# EAGLE design NES_IO (EAGLE 7.2.0)
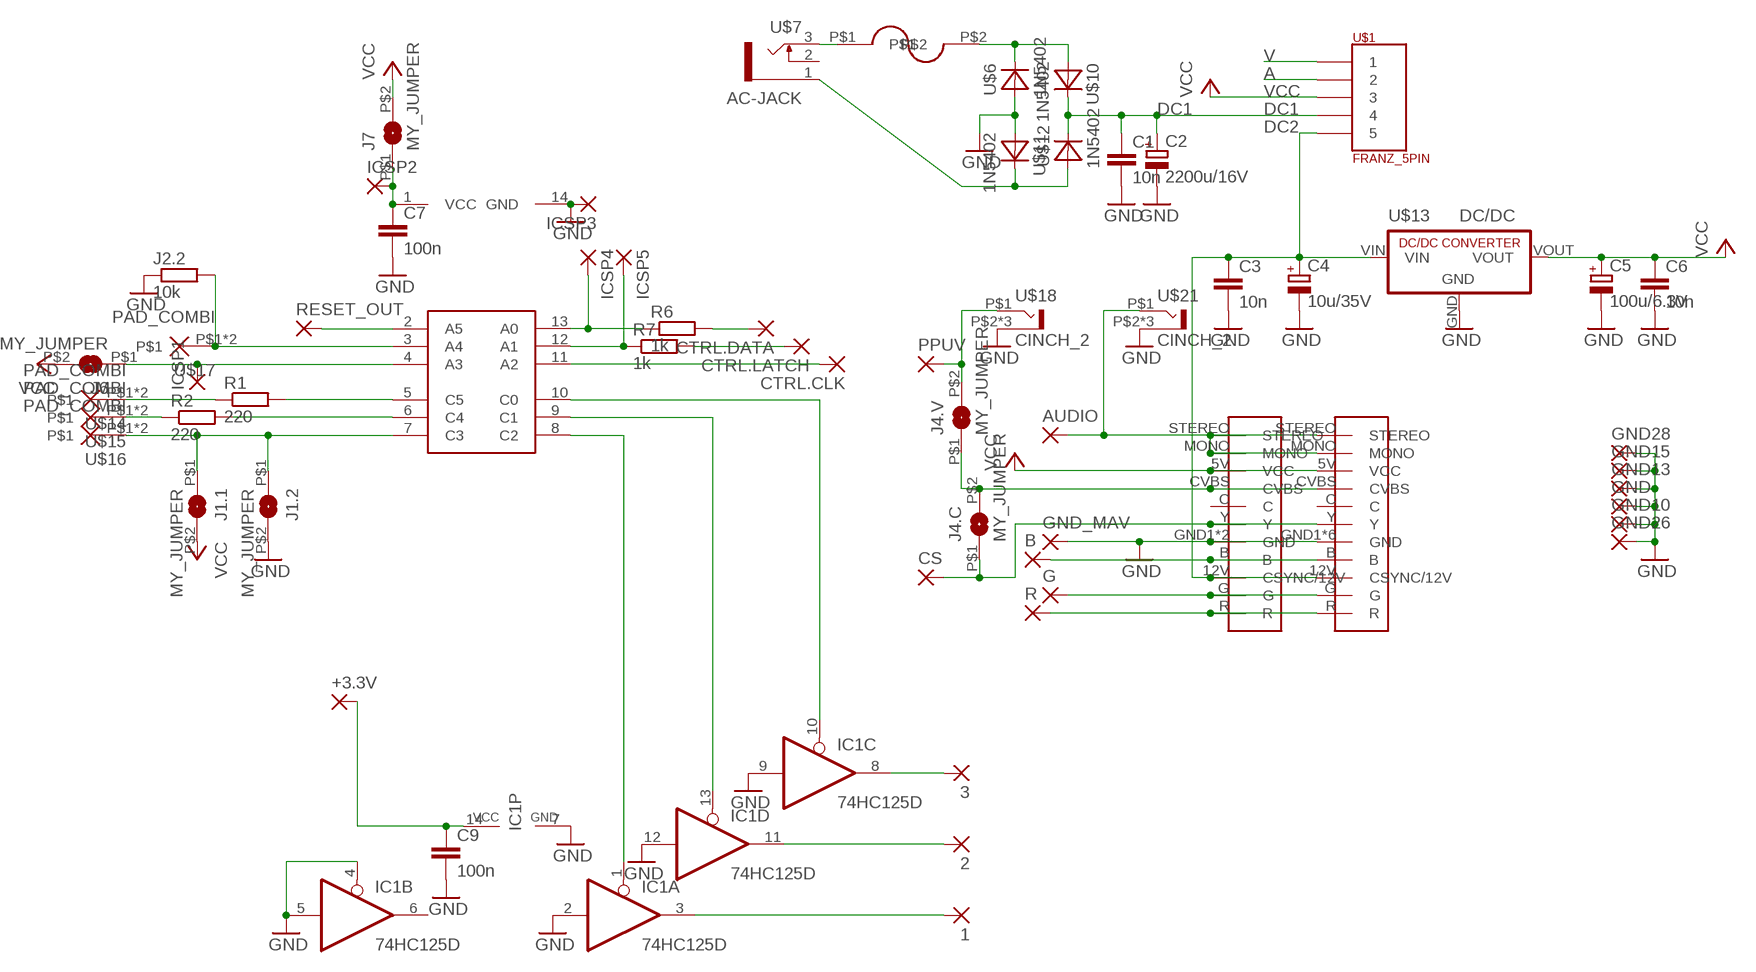
[diagram p0: schematic, sheet 1]

## Parts
1  SMD2  [SMD1,27-2,54]
2  SMD2  [SMD1,27-2,54]
3  SMD2  [SMD1,27-2,54]
+3.3V  SMD2  [SMD1,27-2,54]
AUDIO  SMD2  [SMD1,27-2,54]
B  SMD2  [SMD1,27-2,54]
C1  10n  C0805  [Z0805]
C2  2200u/16V  CPOL-EUE5-13  [E5-13]
C3  10n  C0805  [Z0805]
C4  10u/35V  CPOL-EUB  [PANASONIC_B]
C5  100u/6.3V  CPOL-EUD  [PANASONIC_D]
C6  10n  C0805  [Z0805]
C7  100n  C0805  [Z0805]
C9  100n  C0805  [Z0805]
CS  SMD2  [SMD1,27-2,54]
CTRL.CLK  SMD2  [SMD1,27-2,54]
CTRL.DATA  SMD2  [SMD1,27-2,54]
CTRL.LATCH  SMD2  [SMD1,27-2,54]
G  SMD2  [SMD1,27-2,54]
GND  SMD5  [SMD2,54-5,08]
GND10  SMD5  [SMD2,54-5,08]
GND13  SMD5  [SMD2,54-5,08]
GND15  SMD5  [SMD2,54-5,08]
GND26  SMD5  [SMD2,54-5,08]
GND28  SMD5  [SMD2,54-5,08]
GND_MAV  SMD2  [SMD1,27-2,54]
IC1  74HC125D  [SO14]
ICSP1  1,6/0,8  [1,6/0,8]
ICSP2  1,6/0,8  [1,6/0,8]
ICSP3  1,6/0,8  [1,6/0,8]
ICSP4  1,6/0,8  [1,6/0,8]
ICSP5  1,6/0,8  [1,6/0,8]
J1.1  MY_JUMPER  [MYJUMP]
J1.2  MY_JUMPER  [MYJUMP]
J2.2  10k  R0805  [Z0805]
J4.C  MY_JUMPER  [MYJUMP]
J4.V  MY_JUMPER  [MYJUMP]
J6  MY_JUMPER  [MYJUMP]
J7  MY_JUMPER  [MYJUMP]
PPUV  SMD2  [SMD1,27-2,54]
R  SMD2  [SMD1,27-2,54]
R1  220  R0805  [Z0805]
R2  220  R0805  [Z0805]
R6  1k  R0805  [Z0805]
R7  1k  R0805  [Z0805]
RESET_OUT  SMD2  [SMD1,27-2,54]
U$1  FRANZ_5PIN  [5X2.22RM4]
U$2  FUSEHOLDER  [FUSEHOLDER]
U$5  PIC16F630_SIMPLE  [PIC16F630]
U$6  1N5402  [DO201]
U$7  AC-JACK  [AC-JACK]
U$10  1N5402  [DO201]
U$11  1N5402  [DO201]
U$12  1N5402  [DO201]
U$13  DC/DC  [RECOM]
U$14  PAD_COMBI  [PAD_COMBI]
U$15  PAD_COMBI  [PAD_COMBI]
U$16  PAD_COMBI  [PAD_COMBI]
U$17  PAD_COMBI  [PAD_COMBI]
U$18  CINCH_2  [CINCH_2]
U$19  GC-MULTIAV  [GC-MULTIAV]
U$20  SNES-MULTIAV2  [SNES-MULTIAV2]
U$21  CINCH_2  [CINCH_2]

## Nets
A: U$1.P$2
AC1A: U$2.P$1 U$7.3
AC1B: U$2.P$2 U$6.C U$10.A
AC2: U$7.1 U$11.C U$12.A
DC1: C1.1 C2.+ U$1.P$4 U$10.C U$12.C
DC2: C3.1 C4.+ U$1.P$5 U$13.VIN U$19.12V(CSYNC/12V) U$20.12V(CSYNC/12V)
GND: C1.2 C2.- C3.2 C4.- C5.- C6.2 C7.2 C9.2 GND10.1(P) GND13.1(P) GND15.1(P) GND26.1(P) GND28.1(P) GND.1(P) GND_MAV.1(P) IC1.2(A:I) IC1.4(B:OE) IC1.5(B:I) IC1.7(P:GND) IC1.9(C:I) IC1.12(D:I) ICSP3.1(P) J1.2.P$2 J2.2.1 U$5.14(GND) U$6.A U$11.A U$13.GND U$18.P$2(S) U$18.P$3(S) U$18.P$4(S) U$19.GND1(GND) U$19.GND2(GND) U$19.GND3(GND) U$19.GND4(GND) U$19.GND5(GND) U$19.GND6(GND) U$20.GND1(GND) U$20.GND2(GND) U$21.P$2(S) U$21.P$3(S) U$21.P$4(S)
N$5: AUDIO.1(P) U$19.MONO U$19.STEREO U$20.MONO U$20.STEREO U$21.P$1(T)
N$6: B.1(P) U$19.B U$20.B
N$7: CS.1(P) J4.C.P$1 U$19.Y U$20.Y
N$8: G.1(P) U$19.G U$20.G
N$9: R.1(P) U$19.R U$20.R
N$11: 3.1(P) IC1.8(C:O)
N$12: J2.2.2 U$5.3(A4) U$17.P$1 U$17.P$2
N$13: R1.2 U$5.5(C5)
N$14: R2.2 U$5.6(C4)
N$15: R1.1 U$14.P$1 U$14.P$2
N$16: R2.1 U$15.P$1 U$15.P$2
N$17: J1.1.P$1 J1.2.P$1 U$5.7(C3) U$16.P$1 U$16.P$2
N$19: CTRL.DATA.1(P) R6.2
N$20: CTRL.LATCH.1(P) R7.2
N$21: CTRL.CLK.1(P) U$5.11(A2)
N$23: IC1.10(C:OE) U$5.10(C0)
N$24: IC1.13(D:OE) U$5.9(C1)
N$25: IC1.1(A:OE) U$5.8(C2)
N$26: +3.3V.1(P) C9.1 IC1.14(P:VCC)
N$27: 1.1(P) IC1.3(A:O)
N$28: 2.1(P) IC1.11(D:O)
N$29: J4.V.P$2 PPUV.1(P) U$18.P$1(T)
N$30: J4.C.P$2 J4.V.P$1 U$19.CVBS U$20.CVBS
N$31: C7.1 ICSP2.1(P) J7.P$1 U$5.1(VCC)
N$32: ICSP1.1(P) J6.P$1 U$5.4(A3)
N$33: ICSP4.1(P) R6.1 U$5.13(A0)
N$34: ICSP5.1(P) R7.1 U$5.12(A1)
N$35: RESET_OUT.1(P) U$5.2(A5)
V: U$1.P$1
VCC: C5.+ C6.1 J1.1.P$2 J6.P$2 J7.P$2 U$1.P$3 U$13.VOUT U$19.5V(VCC) U$20.5V(VCC)
Unconnected: IC1.6(B:O) U$7.2 U$19.C U$20.C

## Library data of the parts
1-3 +3.3V AUDIO B CS CTRL.CLK CTRL.DATA CTRL.LATCH G GND_MAV PPUV R RESET_OUT = wirepad:SMD2: SMD PAD
C1 C3 C6 C7 C9 = snes_div:C0805
C2 = resistor:CPOL-EU: POLARIZED CAPACITOR, European symbol
C4 C5 = rcl:CPOL-EU: POLARIZED CAPACITOR, European symbol
GND GND10 GND13 GND15 GND26 GND28 = wirepad:SMD5: SMD PAD
IC1 = 74xx-eu:74*125: Quad bus BUFFER, 3-state
ICSP1-ICSP5 = wirepad:1,6/0,8: THROUGH-HOLE PAD
J1.1 J1.2 J4.C J4.V J6 J7 = snes_div:MY_JUMPER
J2.2 R1 R2 R6 R7 = snes_div:R0805
U$1 = schnaustlib:FRANZ_5PIN
U$2 = nintendo:FUSEHOLDER
U$5 = snes_div:PIC16F630_SIMPLE
U$6 U$10-U$12 = nintendo:1N5402
U$7 = nintendo:AC-JACK
U$13 = nintendo:DC/DC
U$14-U$17 = MS_Mod:PAD_COMBI
U$18 U$21 = nintendo:CINCH_2
U$19 = nintendo:GC-MULTIAV
U$20 = nintendo:SNES-MULTIAV2

## Board
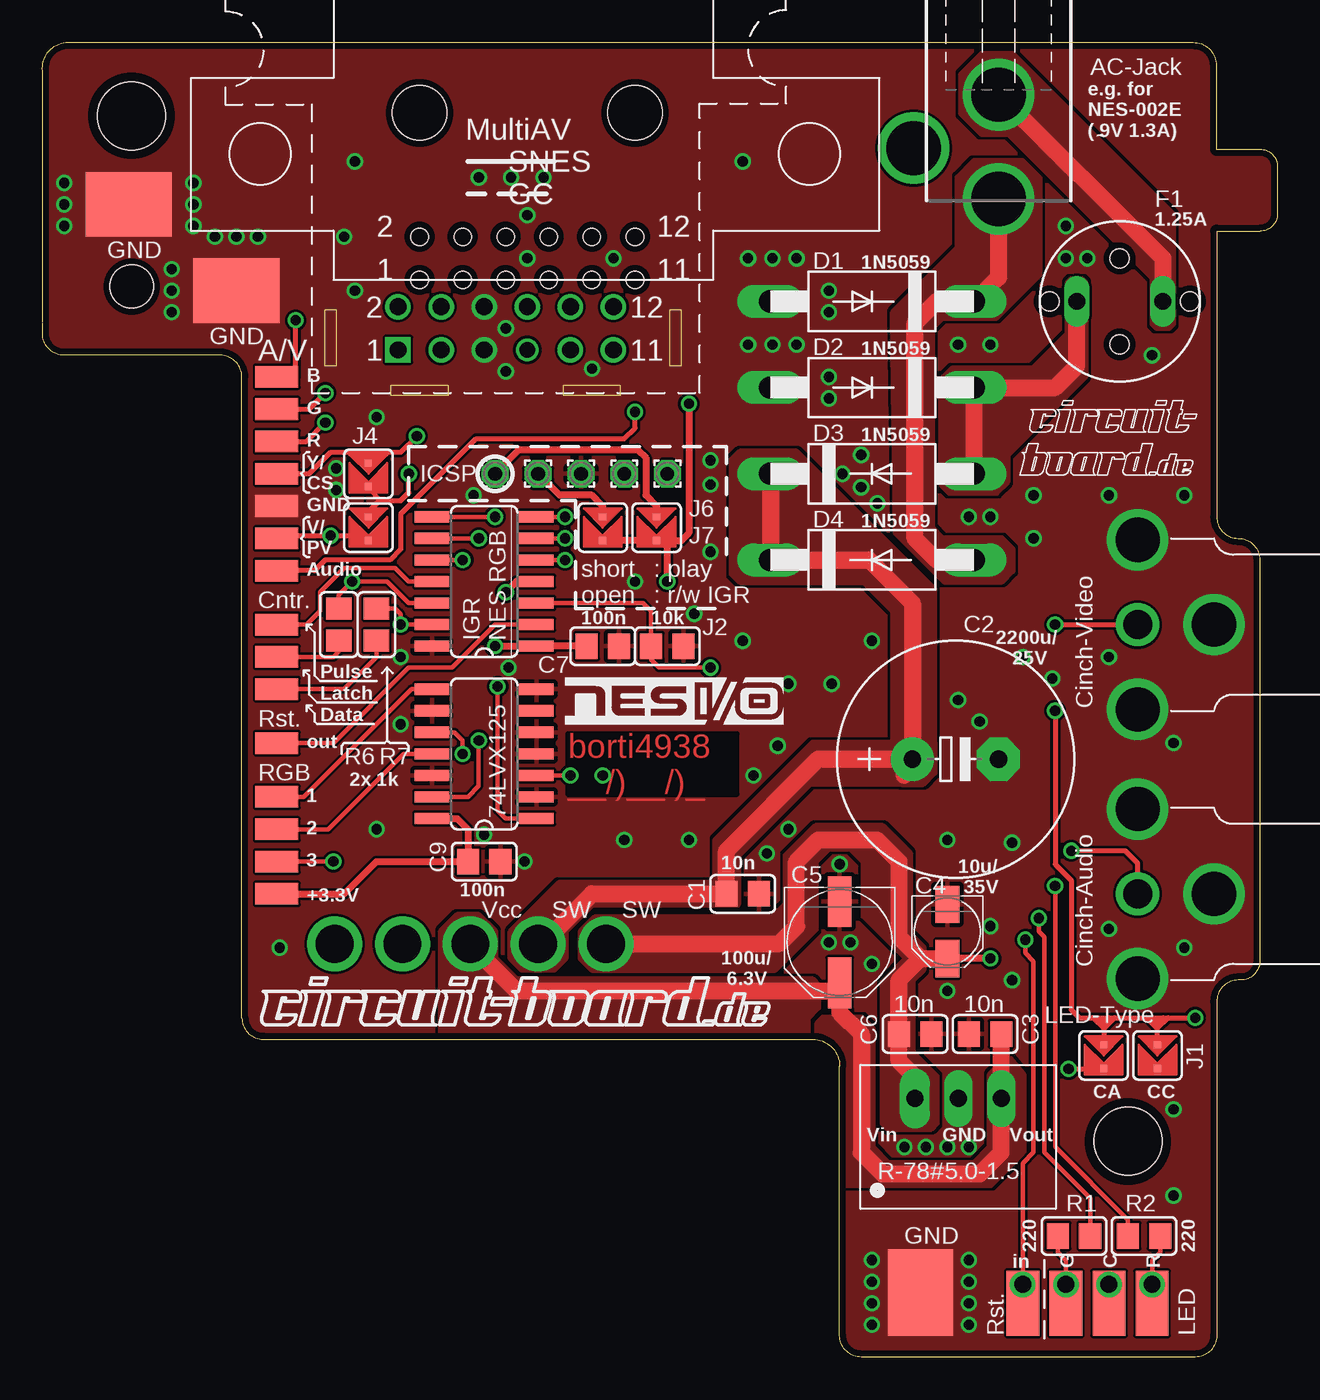
[diagram p1: board, top side]
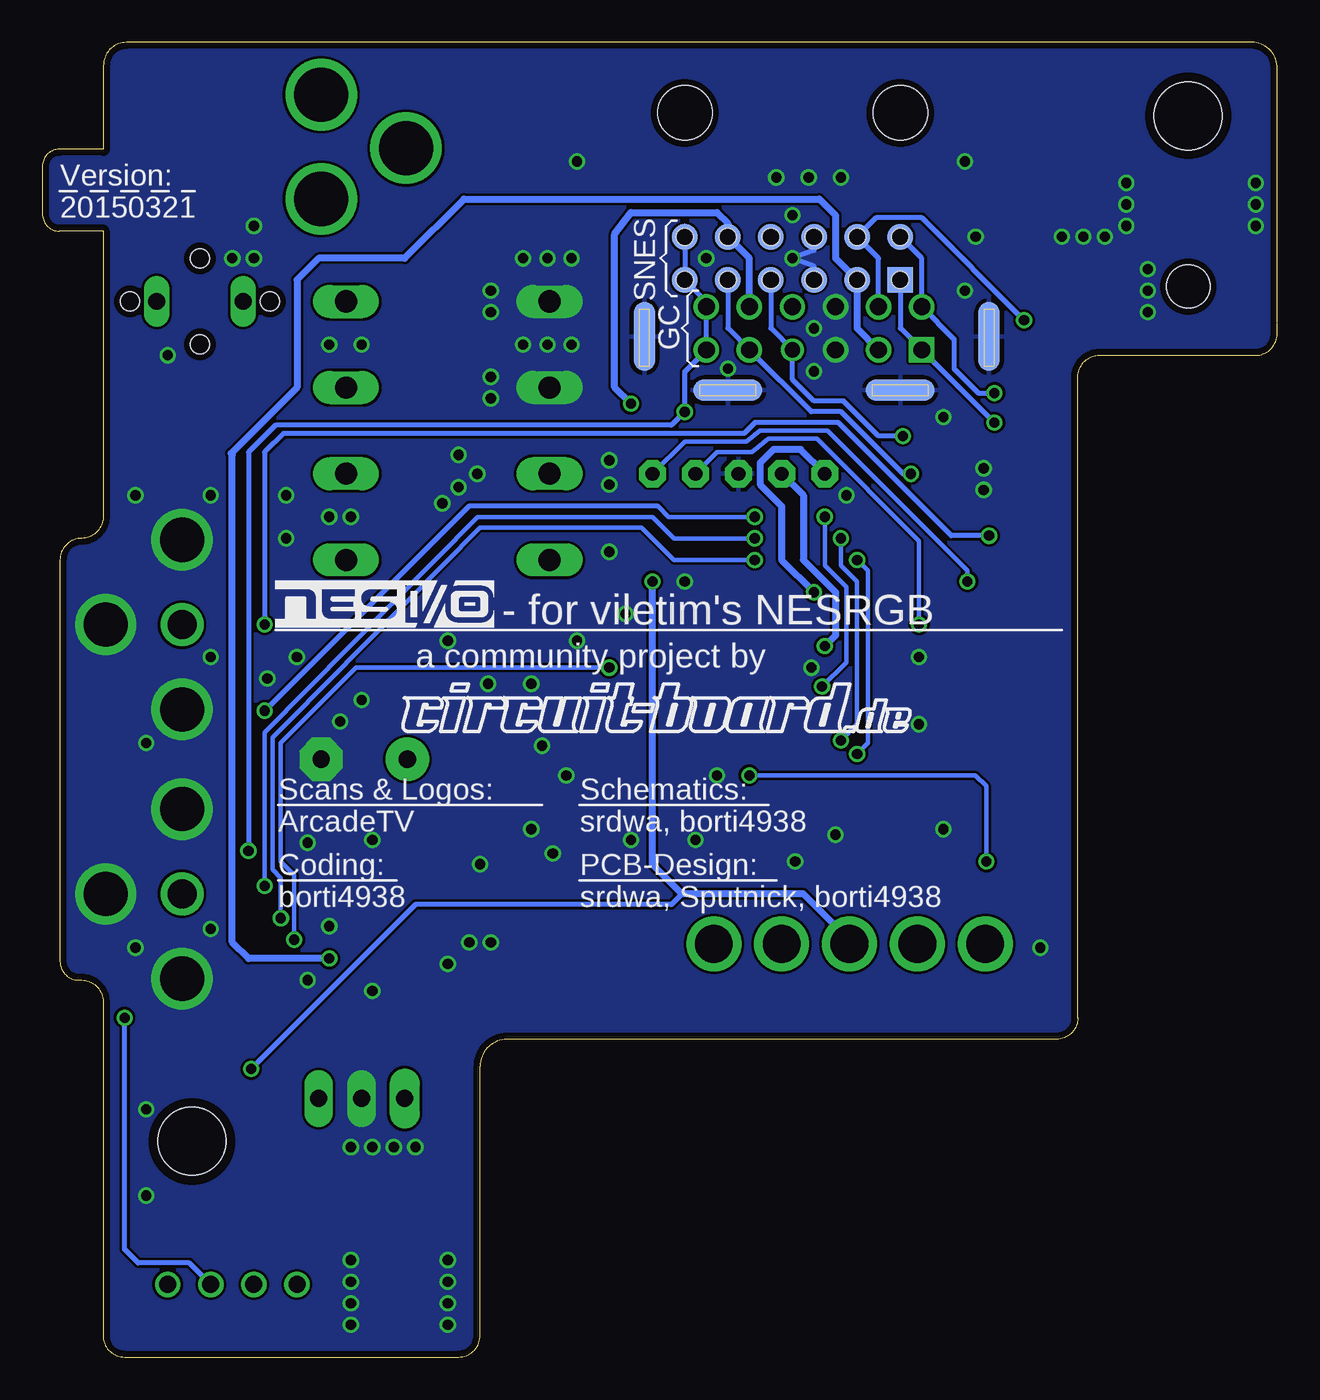
[diagram p2: board, bottom side, seen from below]

Size 72.8 x 77.5 mm. Coordinates in mm from the lower left corner, seen from the top.
Outline: 0.01,61.01 0.01,75.81 arc-90 1.37,77.5 67.84,77.5 arc-90 69.2,76.13 69.2,71.2 71.8,71.2 arc-90 72.8,70.2 72.8,67.37 arc-90 71.8,66.37 69.22,66.37 69.22,49.53 arc90 70.49,48.26 arc-90 71.76,46.99 71.76,23.34 arc-90 70.65,22.23 70.49,22.23 arc90 69.22,20.95 69.22,1.27 arc-90 67.95,0 48.27,0 arc-90 47,1.27 47,17.14 arc90 45.41,18.73 13.03,18.73 arc-90 11.76,20 11.76,57.78 arc90 10.49,59.05 1.28,59.05 arc-90 0.01,60.33 0.01,60.96
Copper layers (1*16): Top 0.0356mm / dielectric 1.5011mm / Bottom 0.0356mm
Design rules "LaenPCBOrder": minimum track width 6mil, minimum drill 13mil, track to track 6mil, track to pad 6mil, pad to pad 6mil, via to via 6mil, smd to smd 6mil, copper to edge 15mil, drill to drill 6mil, minimum pad ring 7mil, minimum via ring 7mil, stop-mask expansion 3mil, vias tented up to drill 0mil, thermal gap 10mil
Holes 4 mm at 5.26,73.16 63.99,12.73
Holes 2.54 mm at 5.26,63.11
tRestrict: area 62,10.7 to 66,14.7; area 3.2,71.2 to 7.3,75.2
bRestrict: area 62,10.7 to 66,14.7; area 3.2,71.2 to 7.3,75.2

### Footprints (pad centres in the part's own frame; a part is rotated, then mirrored left to right if it is on the bottom)
SMD1,27-2,54 = smd 1.27 x 2.54: 1 0,0
Z0805 = smd 1.3 x 1.5: 1 -0.95,0; 2 0.95,0
E5-13 = drill 1.016 pad 2.54: + -2.54,0 | drill 1.016 pad 2.54 octagon: - 2.54,0
PANASONIC_B = smd 2.2 x 1.4: + 1.6,0; - -1.6,0
PANASONIC_D = smd 3 x 1.4: + 2.4,0; - -2.4,0
SMD2,54-5,08 = smd 2.54 x 5.08: 1 0,0
SO14 = smd 0.66 x 2.032: 1 -3.81,-3.073; 2 -2.54,-3.073; 3 -1.27,-3.073; 4 0,-3.073; 5 1.27,-3.073; 6 2.54,-3.073; 7 3.81,-3.073; 8 3.81,3.073; 9 2.54,3.073; 10 1.27,3.073; 11 0,3.073; 12 -1.27,3.073; 13 -2.54,3.073; 14 -3.81,3.073
1,6/0,8 = drill 0.813 pad 1.6 octagon: 1 0,0
MYJUMP = smd 0.406 x 0.406: P$1 -0.635,0; P$2 0.765,0
5X2.22RM4 = drill 2.22: P$1 -8,0; P$2 -4,0; P$3 0,0; P$4 4,0; P$5 8,0
FUSEHOLDER = drill 1 pad 1.422 long: P$1 -2.54,0; P$2 2.54,0 | hole 1.1: 0,2.54; 0,-2.54; 4.128,0; -4.128,0
PIC16F630 = smd 0.66 x 2.032: 1 -3.81,-3.073; 2 -2.54,-3.073; 3 -1.27,-3.073; 4 0,-3.073; 5 1.27,-3.073; 6 2.54,-3.073; 7 3.81,-3.073; 8 3.81,3.073; 9 2.54,3.073; 10 1.27,3.073; 11 0,3.073; 12 -1.27,3.073; 13 -2.54,3.073; 14 -3.81,3.073
DO201 = drill 1.3 long: A 6,0; C -6,0
AC-JACK = drill 3.2 pad 4: 1 0,8.57; 2 5,5.57; 3 0,2.42
RECOM = drill 1 pad 1.676 long: GND 0,0; VOUT 2.54,0 | drill 1 pad 1.778 long: VIN -2.54,0
PAD_COMBI = smd 1.93 x 3.81: P$1 0,0 | drill 1: P$2 0,1.111
CINCH_2 = drill 1.7: P$1 0,-4.5 | drill 2.6: P$2 -5,-4.5; P$3 5,-4.5; P$4 0,0
GC-MULTIAV = drill 1: 5V 15.24,5.08; 12V 7.62,2.54; B 7.62,5.08; C 12.7,5.08; CVBS 15.24,2.54; G 5.08,5.08; GND1 10.16,2.54; GND2 10.16,5.08; MONO 17.78,2.54; STEREO 17.78,5.08 | smd 1.27 x 4.064 bottom: GND3 1.111,3.334; GND6 21.431,3.334 | smd 4.064 x 1.27 bottom: GND4 6.35,0.159; GND5 16.51,0.159 | drill 1 square: R 5.08,2.54 | drill 0.9: Y 12.7,2.54
SNES-MULTIAV2 = smd 1.524 x 1.524 bottom: 5V 15.24,2.54; 12V 7.62,0; B 7.62,2.54; C 12.7,2.54; CVBS 15.24,0; G 5.08,2.54; GND1 10.16,0; GND2 10.16,2.54; MONO 17.78,0; R 5.08,0; STEREO 17.78,2.54; Y 12.7,0 | hole 3.2: 5.08,9.842; 17.78,9.842 | hole 1: 5.08,0; 5.08,2.54; 7.62,2.54; 10.16,2.54; 12.7,2.54; 12.7,0; 10.16,0; 7.62,0; 15.24,2.54; 17.78,2.54; 17.78,0; 15.24,0

### Placement (x,y rotation side)
1  13.82,29.21 270 top
2  13.82,31.11 270 top
3  13.82,33.02 270 top
+3.3V  13.82,27.3 90 top
AUDIO  13.82,46.35 90 top
B  13.82,57.78 90 top
C1  41.28,27.3 0 top
C2  53.82,35.24 0 top
C3  51.44,19.05 0 top
C4  53.35,25.08 270 top
C5  47,24.45 270 top
C6  55.57,19.05 180 top
C7  33.03,41.91 0 top
C9  26.04,29.21 0 top
CS  13.82,52.07 90 top
CTRL.CLK  13.82,43.18 270 top
CTRL.DATA  13.82,39.37 270 top
CTRL.LATCH  13.82,41.27 270 top
G  13.82,55.88 90 top
GND  5.09,68.58 90 top
GND10  51.13,3.81 180 top
GND13  52.4,3.81 0 top
GND15  11.44,62.23 90 top
GND26  11.44,63.5 90 top
GND28  5.09,67.31 90 top
GND_MAV  13.82,50.16 270 top
IC1  26.04,35.56 90 top
ICSP1  26.68,52.07 0 top
ICSP2  29.22,52.07 0 top
ICSP3  31.76,52.07 0 top
ICSP4  34.3,52.07 0 top
ICSP5  36.84,52.07 0 top
J1.1  62.56,17.78 270 top
J1.2  65.73,17.78 270 top
J2.2  36.84,41.91 180 top
J4.C  19.22,52.07 270 top
J4.V  19.22,48.9 270 top
J6  36.2,48.9 270 top
J7  33.03,48.9 270 top
PPUV  13.82,48.26 90 top
R  13.82,53.98 90 top
R1  60.81,7.14 0 top
R2  64.94,7.14 180 top
R6  19.69,43.18 270 top
R7  17.47,43.18 270 top
RESET_OUT  13.82,36.2 90 top
U$1  25.22,24.36 0 top
U$2  63.51,62.23 180 top
U$3  [NESIO-LOGO]  30.81,37.31 0 top
U$4  [NESIO-LOGO]  59.06,43.02 0 bottom
U$5  26.04,45.72 90 top
U$6  48.9,57.15 180 top
U$7  56.36,76.83 180 top
U$10  48.9,52.07 0 top
U$11  48.9,62.23 180 top
U$12  48.9,46.99 0 top
U$13  53.98,15.24 0 top
U$14  60.33,3.17 0 top
U$15  65.41,3.17 0 top
U$16  62.87,3.17 0 top
U$17  57.79,3.17 0 top
U$18  69.06,43.18 270 top
U$19  15.88,56.83 0 top
U$20  17.15,63.5 0 top
U$21  69.06,27.3 270 top

### Tracks (layer width: path | path; a pad name or v marks a point on that pad's centre or on a via)
AC1A
  Top 1.016: U$7.3 56.36,74.45 66.05,64.77 U$2.P$1
  pour Top (no thermals): 55.41,76.68 57.16,76.68 66.52,67.31 66.52,60.96 66.37,60.8 65.73,60.8 65.57,60.96 65.57,63.66 57,72.23 55.41,72.23 54.3,73.34 54.3,75.56
AC1B
  Top 1.016: U$10.A U$6.C 59.7,57.15 60.97,58.42 U$2.P$2
  pour Top (no thermals): 61.29,63.5 61.44,63.34 61.44,57.78 56.84,53.18 56.84,51.59 56.21,50.96 53.51,50.96 53.03,51.44 53.03,57.63 53.67,58.26 58.43,58.26 60.49,60.33 60.49,63.34 60.65,63.5
AC2
  Top 1.016: U$7.1 56.36,63.66 54.94,62.23 U$11.C 52.71,62.23 51.44,60.96 51.44,48.26 52.71,46.99 U$12.A
  pour Top (rank 2, no thermals): 53.98,65.41 53.98,69.53 54.94,70.48 57.79,70.48 58.75,69.53 58.75,63.82 56.21,61.28 53.03,61.28 52.4,60.64 52.4,48.9 53.03,48.26 56.52,48.26 57.16,47.62 57.16,46.35 56.52,45.72 53.19,45.72 50.33,48.58 50.17,61.59
DC1
  Top 1.016: 29.29,24.36 29.45,24.36 32.39,27.3 C1.1 40.33,29.84 45.73,35.24 C2.+ | U$10.C U$12.C 48.74,46.99 51.28,44.45 C2.+ | C2.+ 51.28,34.77 50.81,34.29 50.81,34.77 C2.+
  pour Top (no thermals): 45.41,36.2 52.55,36.2 52.55,34.45 51.6,33.81 45.25,33.81 40.97,29.53 40.97,26.67 32.39,26.67 30.81,25.08 30.81,23.5 30.17,22.86 28.27,22.86 27.63,23.5 27.63,25.08 30.49,27.94 39.7,27.94 39.7,30.48
  pour Top (no thermals): 44.46,53.34 41.12,53.34 40.65,52.86 40.65,46.2 41.12,45.72 48.43,45.72 50.17,43.97 50.17,34.29 50.65,33.81 51.92,33.81 52.55,34.45 52.55,45.24
DC2  (via drill 0.6)
  Top 0.406: v55.89,23.5 53.36,23.5 C4.+
  Top 1.016: U$1.P$5 43.42,24.36 44.46,25.4 44.46,29.21 45.73,30.48 49.22,30.48 50.49,29.21 50.49,24.77 51.76,23.5 | 51.76,23.5 53.34,23.5 C4.+ | 51.76,23.5 50.49,22.23 C3.1 50.49,17.46 51.44,16.51 U$13.VIN
  Bottom 0.406: U$19.12V 24.77,60.64 U$20.12V 26.04,64.77 26.04,67.31 27,68.26 47.95,68.26 51.44,64.77 56.52,64.77 57.79,63.5 57.79,57.15 61.68,53.26 61.6,53.18 61.6,24.45 60.65,23.5 v55.89,23.5
  pour Top (no thermals): 31.76,25.08 31.76,23.5 32.39,22.86 43.19,22.86 45.57,25.24 45.57,29.21 46.36,30 47.63,30 48.43,29.21 48.43,26.04 50.97,23.5 49.54,22.07 49.54,13.81 49.86,13.49 52.4,13.49 52.71,13.81 52.71,16.51 51.28,17.94 51.28,22.23 51.92,22.86 51.92,24.13 51.13,24.92 51.13,29.69 49.54,31.27 45.57,31.27 43.82,29.53 43.82,26.67 43.03,25.88 32.55,25.88
GND  (via drill 0.6)
  Top 1.016: 10.17,64.14 11.44,64.14 GND26.1
  Bottom 0.305: U$20.GND2 27.31,65.25 v28.58,64.77 27.31,64.29 U$20.GND1
  other vias: 21.12,41.27 43.98,39.69 33.03,34.29 28.42,29.21 67.32,24.13 17.31,52.39 11.44,66.04 10.17,66.04 8.9,69.22 8.9,67.94 8.9,66.67 7.63,62.87 7.63,64.14 7.63,61.59 1.28,69.22 1.28,67.94 1.28,66.67 12.71,66.04 38.11,30.48 13.98,24.13 55.89,25.4 34.3,30.48 62.87,25.24 59.54,40.01 17.31,51.12 46.36,24.45 47.63,24.45 62.87,41.27 48.9,5.71 48.9,4.45 48.9,3.17 48.9,1.91 54.62,5.71 54.62,4.45 54.62,3.17 54.62,1.91 54.62,12.38 66.68,14.61 66.68,9.53 66.68,36.2 27.47,40.64 38.43,43.81 39.38,47.47 34.93,45.72 43.03,64.77 44.46,64.77 41.6,64.77 18.42,70.48 41.28,70.48 27.63,69.53 46.36,61.59 41.28,42.23 53.35,30.48 42.71,29.69 46.52,39.69 53.98,59.69 55.89,59.69 60.33,66.67 67.32,50.8 53.35,21.59 57.16,22.23 52.08,12.38 41.92,34.29 43.03,59.69 41.6,59.69 39.38,51.44 25.41,50.8 47,29.05 53.35,12.38 46.36,62.87 48.9,42.23 28.58,67.31 48.9,23.18 50.81,12.38 19.69,31.11 29.54,69.53 25.73,69.53 17.79,66.04 46.36,56.52 46.36,57.78 19.69,55.4 43.98,31.11 21.12,37.31 26.04,30.8 27.31,60.64 32.39,58.26 27.31,58.1 33.66,64.77 44.46,59.69 39.38,52.86 55.25,37.47 47.16,52.07 18.42,62.87 54.62,49.53 61.6,64.77 65.41,59.05 60.33,64.77 55.89,49.53 58.43,50.8 62.87,50.8 57.16,30.32 57.79,41.27 58.43,48.26 49.22,50.32 48.27,53.18 48.27,51.28 53.98,38.73 43.35,36.04
  pour Bottom (rank 6): 0.01,0 73.67,0 73.67,77.47 0.01,77.47
  pour Top (rank 5, no thermals): 0.01,48.26 0.01,71.12 16.52,71.12 16.52,48.26
  pour Top (rank 5, no thermals): 48.27,7.62 55.89,7.62 55.89,0 48.27,0
  pour Bottom (rank 5, no thermals): 58.43,38.1 53.82,38.1 53.82,31.75 58.43,31.75
  pour Top (rank 5, no thermals): 58.43,38.1 53.82,38.1 53.82,31.75 58.43,31.75
  pour Top (rank 6): 0.01,0 73.67,0 73.67,77.31 0.01,77.47
  pour Bottom (no thermals): 62.24,50.8 72.4,50.8 72.4,20.32 62.24,20.32
  pour Top (no thermals): 62.24,50.8 72.4,50.8 72.4,20.32 62.24,20.32
N$5  (via drill 0.6)
  Top 0.305: AUDIO.1 16.04,46.35 16.68,46.99 20.49,46.99 21.12,47.62 21.12,49.69 25.57,54.13 34.3,54.13 34.93,54.77 v34.93,55.72 | U$21.P$1 64.56,29.11 63.83,29.84 v60.65,29.84
  Bottom 0.305: U$20.STEREO U$20.MONO 33.66,62.23 U$19.STEREO U$19.MONO 34.93,58.1 v34.93,55.72 35.73,54.93 59.06,54.93 60.65,53.34 v60.65,29.84
N$6  (via drill 0.6)
  Top 0.305: B.1 14.93,57.78 v14.93,61.12
  Bottom 0.305: U$19.B 23.5,64.77 U$20.B 23.66,67.15 20.96,67.15 v14.93,61.12
N$7  (via drill 0.6)
  Top 0.305: CS.1 15.72,52.07 16.99,53.34 19.06,53.34 | J4.C.P$1 19.06,53.34 | 19.06,53.34 21.12,53.34 v22.07,54.29
  Bottom 0.305: U$20.Y 29.85,60.64 U$19.Y 28.58,57.63 27.31,56.36 25.57,56.36 23.5,54.29 v22.07,54.29
N$8  (via drill 0.6)
  Top 0.305: G.1 15.72,55.88 v16.68,56.83
  Bottom 0.305: U$20.G 20.96,64.77 U$19.G 19.06,60.01 19.06,58.26 17.63,56.83 v16.68,56.83
N$9  (via drill 0.6)
  Top 0.305: R.1 15.57,53.98 v16.68,55.09
  Bottom 0.305: U$20.R 22.23,60.64 U$19.R v16.68,55.09
N$11
  Top 0.254: IC1.8 21.76,39.37 15.41,33.02 3.1
N$12  (via drill 0.6)
  Top 0.254: U$17.P$2 57.79,11.43 58.43,12.06 58.43,23.34 57.95,23.81 v57.95,24.61 | U$5.3 35.41,44.45 35.89,43.97 J2.2.2 35.89,41.12 36.36,40.64 v39.38,40.64
  Top 0.305: U$17.P$1 U$17.P$2
  Bottom 0.254: v39.38,40.64 54.3,40.64 58.75,36.2 58.75,29.21 57.95,28.42 v57.95,24.61
N$13  (via drill 0.6)
  Top 0.254: U$5.5 v30.81,46.99 | R1.2 61.76,9.37 59.06,12.06 59.06,24.77 58.75,25.08 v58.75,25.88
  Bottom 0.254: v30.81,46.99 35.57,46.99 37.47,48.9 47,48.9 58.27,37.47 59.22,36.51 59.22,28.73 58.75,28.26 v58.75,25.88
N$14  (via drill 0.6)
  Top 0.254: U$5.6 v30.81,48.26 | R2.2 63.99,8.09 59.7,12.38 v59.7,27.78
  Bottom 0.254: v30.81,48.26 35.57,48.26 36.84,49.53 47.16,49.53 59.7,36.83 v59.7,27.78
N$15  (via drill 1)
  Top 0.254: R1.1 59.86,6.19 60.33,5.71 U$14.P$2
  Top 0.305: U$14.P$1 U$14.P$2
  other vias: 60.33,4.29
N$16  (via drill 1)
  Top 0.254: R2.1 65.89,6.19 65.41,5.71 U$15.P$2
  Top 0.305: U$15.P$1 U$15.P$2
  other vias: 65.41,4.29
N$17  (via drill 0.6)
  Top 0.254: U$5.7 v30.81,49.53
  Top 0.305: U$16.P$1 U$16.P$2 | 62.56,19.37 J1.1.P$1 | 65.41,18.73 J1.2.P$1 65.73,19.37 | v59.7,38.1 59.7,29.05 60.65,28.1 60.65,20.48 61.13,20 61.92,20 | 62.56,19.37 61.92,20 | 65.73,19.37 65.1,20 | 61.92,20 62.87,20 | 62.87,20 63.19,20 | 63.19,20 62.56,19.37 | 62.56,19.37 62.56,19.53 62.24,19.84 62.56,19.84 62.71,19.68 62.71,19.84 62.87,20 | 63.19,20 65.1,20 | 65.1,20 66.05,20 | 66.05,20 66.37,20 | 66.37,20 65.73,19.37 | 65.73,19.37 65.73,19.53 65.41,19.84 65.73,19.84 65.89,19.68 65.89,19.84 66.05,20 | 66.37,20 v67.95,20
  Bottom 0.254: v30.81,49.53 35.89,49.53 36.52,50.16
  Bottom 0.305: 36.52,50.16 47.63,50.16 v59.7,38.1 | U$16.P$2 64.14,5.56 67.16,5.56 67.95,6.35 v67.95,20
N$19
  Top 0.254: CTRL.DATA.1 17.79,39.37 19.69,41.27 R6.2
N$20
  Top 0.254: CTRL.LATCH.1 17.15,41.27 17.47,41.59 R7.2
N$21
  Top 0.254: CTRL.CLK.1 15.57,43.18 16.36,43.97 16.36,45.09 17.79,46.51 20.8,46.51 21.6,45.72 U$5.11
N$23  (via drill 0.6)
  Top 0.254: U$5.10 v24.77,46.99 | IC1.10 24.3,36.83 24.77,36.35 v24.77,35.56
  Bottom 0.254: v24.77,46.99 24.14,46.35 24.14,36.2 v24.77,35.56
N$24  (via drill 0.6)
  Top 0.254: IC1.13 25.09,33.02 25.73,33.66 v25.73,36.35 | U$5.9 v25.73,48.26
  Bottom 0.254: v25.73,48.26 25.73,46.67 24.77,45.72 24.77,37.31 v25.73,36.35
N$25  (via drill 0.6)
  Top 0.254: U$5.8 v26.68,49.53 | v26.84,39.53 26.84,32.23 27.31,31.75 IC1.1
  Bottom 0.254: v26.68,49.53 26.68,46.67 25.41,45.4 25.41,40.96 v26.84,39.53
N$26
  Top 0.254: C9.1
  Top 0.406: +3.3V.1 17.79,27.3 19.69,29.21 C9.1 | C9.1 25.09,31.11 24.46,31.75 IC1.14
N$27  (via drill 0.6)
  Top 0.254: 1.1 v17.15,29.21 | v31.12,34.29 IC1.3
  Bottom 0.254: v17.15,29.21 17.15,33.66 17.79,34.29 v31.12,34.29
N$28
  Top 0.254: 2.1 16.84,31.11 21.28,35.56 IC1.11
N$29  (via drill 0.6)
  Top 0.305: 18.93,48.26 J4.V.P$2 18.77,48.42 v16.99,48.42 14.93,48.42 14.77,48.26 PPUV.1 | v59.7,43.18 U$18.P$1
  Bottom 0.305: v16.99,48.42 19.22,48.42 25.88,55.09 30.81,55.09 31.44,54.45 58.59,54.45 59.7,53.34 v59.7,43.18
N$30  (via drill 0.6)
  Top 0.305: 19.88,50.48 J4.C.P$2 | J4.V.P$1 19.06,49.66 19.88,50.48 | 19.88,50.48 21.12,50.48 21.6,50.96 v21.6,52.07
  Bottom 0.305: U$20.CVBS 32.39,60.64 U$19.CVBS 27.47,55.72 25.73,55.72 22.07,52.07 v21.6,52.07
  pour Top (no thermals): 19.22,49.53 20.17,50.48 19.22,51.44
N$31  (via drill 0.6)
  Top 0.406: J7.P$1 33.03,50.16 32.39,50.8 30.49,50.8 ICSP2.1 | v26.68,41.91 U$5.1 C7.1
  Bottom 0.406: v26.68,41.91 26.04,42.55 26.04,45.09 27.95,46.99 27.95,50.8 ICSP2.1
N$32  (via drill 0.6)
  Top 0.406: J6.P$1 36.2,50.16 35.57,50.8 35.57,53.02 35.09,53.5 28.11,53.5 ICSP1.1 | U$5.4 27.95,45.72 v27.31,45.09
  Bottom 0.406: ICSP1.1 28.11,53.5 29.69,53.5 30.49,52.7 30.49,51.44 29.22,50.16 29.22,46.99 v27.31,45.09
N$33  (via drill 0.6)
  Top 0.254: U$5.13 v21.12,43.18 21.12,43.81 20.8,44.13 R6.1
  Bottom 0.254: v21.12,43.18 21.12,48.1 27.15,54.13 30.01,54.13 30.96,53.34 33.03,53.34 ICSP4.1
N$34  (via drill 0.6)
  Top 0.254: R7.1 17.47,44.93 v18.26,45.72 20.33,45.72 21.6,44.45 U$5.12
  Bottom 0.254: v18.26,45.72 18.26,46.35 26.52,54.61 30.49,54.61 31.28,53.98 34.93,53.98 ICSP5.1
N$35
  Top 0.254: RESET_OUT.1 17.15,36.2 21.6,40.64 24.14,40.64 26.68,43.18 U$5.2
VCC  (via drill 0.6)
  Top 0.305: v60.49,16.99 62.53,16.99 J1.1.P$2
  Top 0.406: J7.P$2 J6.P$2 36.84,48.13 | 36.84,48.13 37.66,48.13 38.11,48.58 v38.11,56.2 | v36.84,45.72 36.84,48.13
  Top 1.016: C6.1 56.52,18.73 U$13.VOUT 56.52,12.06 55.25,10.79 49.54,10.79 48.27,12.06 48.27,19.05 47,20.32 C5.+ 46.54,21.59 27.95,21.59 25.22,24.32 U$1.P$3
  Bottom 0.305: 35.09,27.3 35.73,26.67 50.81,26.67 v60.49,16.99
  Bottom 0.406: U$1.P$3 25.22,24.58 27.95,27.3 35.09,27.3 36.84,29.05 v36.84,45.72 | v38.11,56.2 39.06,57.15 39.06,66.2 38.11,67.47 33.03,67.47 32.39,66.83 U$20.5V 31.12,64.77 U$19.5V
  pour Top (no thermals): 46.05,20 48.27,20 48.9,19.37 48.9,12.38 49.86,11.43 54.94,11.43 55.89,12.38 55.89,16.67 56.21,16.99 57,17.62 57.79,16.67 57.79,12.06 55.89,10.16 45.73,10.16 45.73,19.68
  pour Top (no thermals): 23.5,25.08 23.5,17.78 44.46,17.78 45.09,18.41 45.09,20 45.73,20.64 45.73,21.91 45.41,22.23 27.95,22.23 26.68,23.5 26.68,25.08 25.73,26.04 24.46,26.04

### Text on the board
Top: borti4938 / __/)__/)_
tNames: AC-Jack | e.g. for / NES-002E / ( 9V 1.3A) | ~ | MultiAV / SNES / GC | F1 | 1.25A | GND | D1 | 1N5059 | GND | A/V | D2 | 1N5059 | B | G | R | J4 | D3 | 1N5059 | ICSP | Y/ / CS | GND | J6 | D4 | 1N5059 | J7 | V/ / PV | Audio | Cntr. | short / open | : play / : r/w IGR | 100n | 10k | J2 | C2 | IGR / NES RGB | 2200u/ / 25V | Pulse | C7 | Latch | Cinch-Video | Rst. | Data | out | R6 | R7 | RGB | 2x | 1k | 1 | 74LVX125 | 2 | 3 | C9 | 10n | C5 | +3.3V | 100n | C4 | 10u/ / 35V | Vcc | SW | SW | C1 | Cinch-Audio | 100u/ / 6.3V | 10n | 10n | LED-Type | C6 | C3 | J1 | CA | CC | Vin | GND | Vout | R-78#5.0-1.5 | R1 | R2 | GND | 220 | 220 | in | G | C | R | Rst. | LED
bNames: SNES | Version: / 20150321 | GC | - for viletim's NESRGB | a community project by | Schematics: / srdwa, borti4938 | Scans & Logos: / ArcadeTV | PCB-Design: / srdwa, Sputnick, borti4938 | Coding: / borti4938